# EAGLE design Adafruit ATtiny816 Breakout (EAGLE 9.6.2)
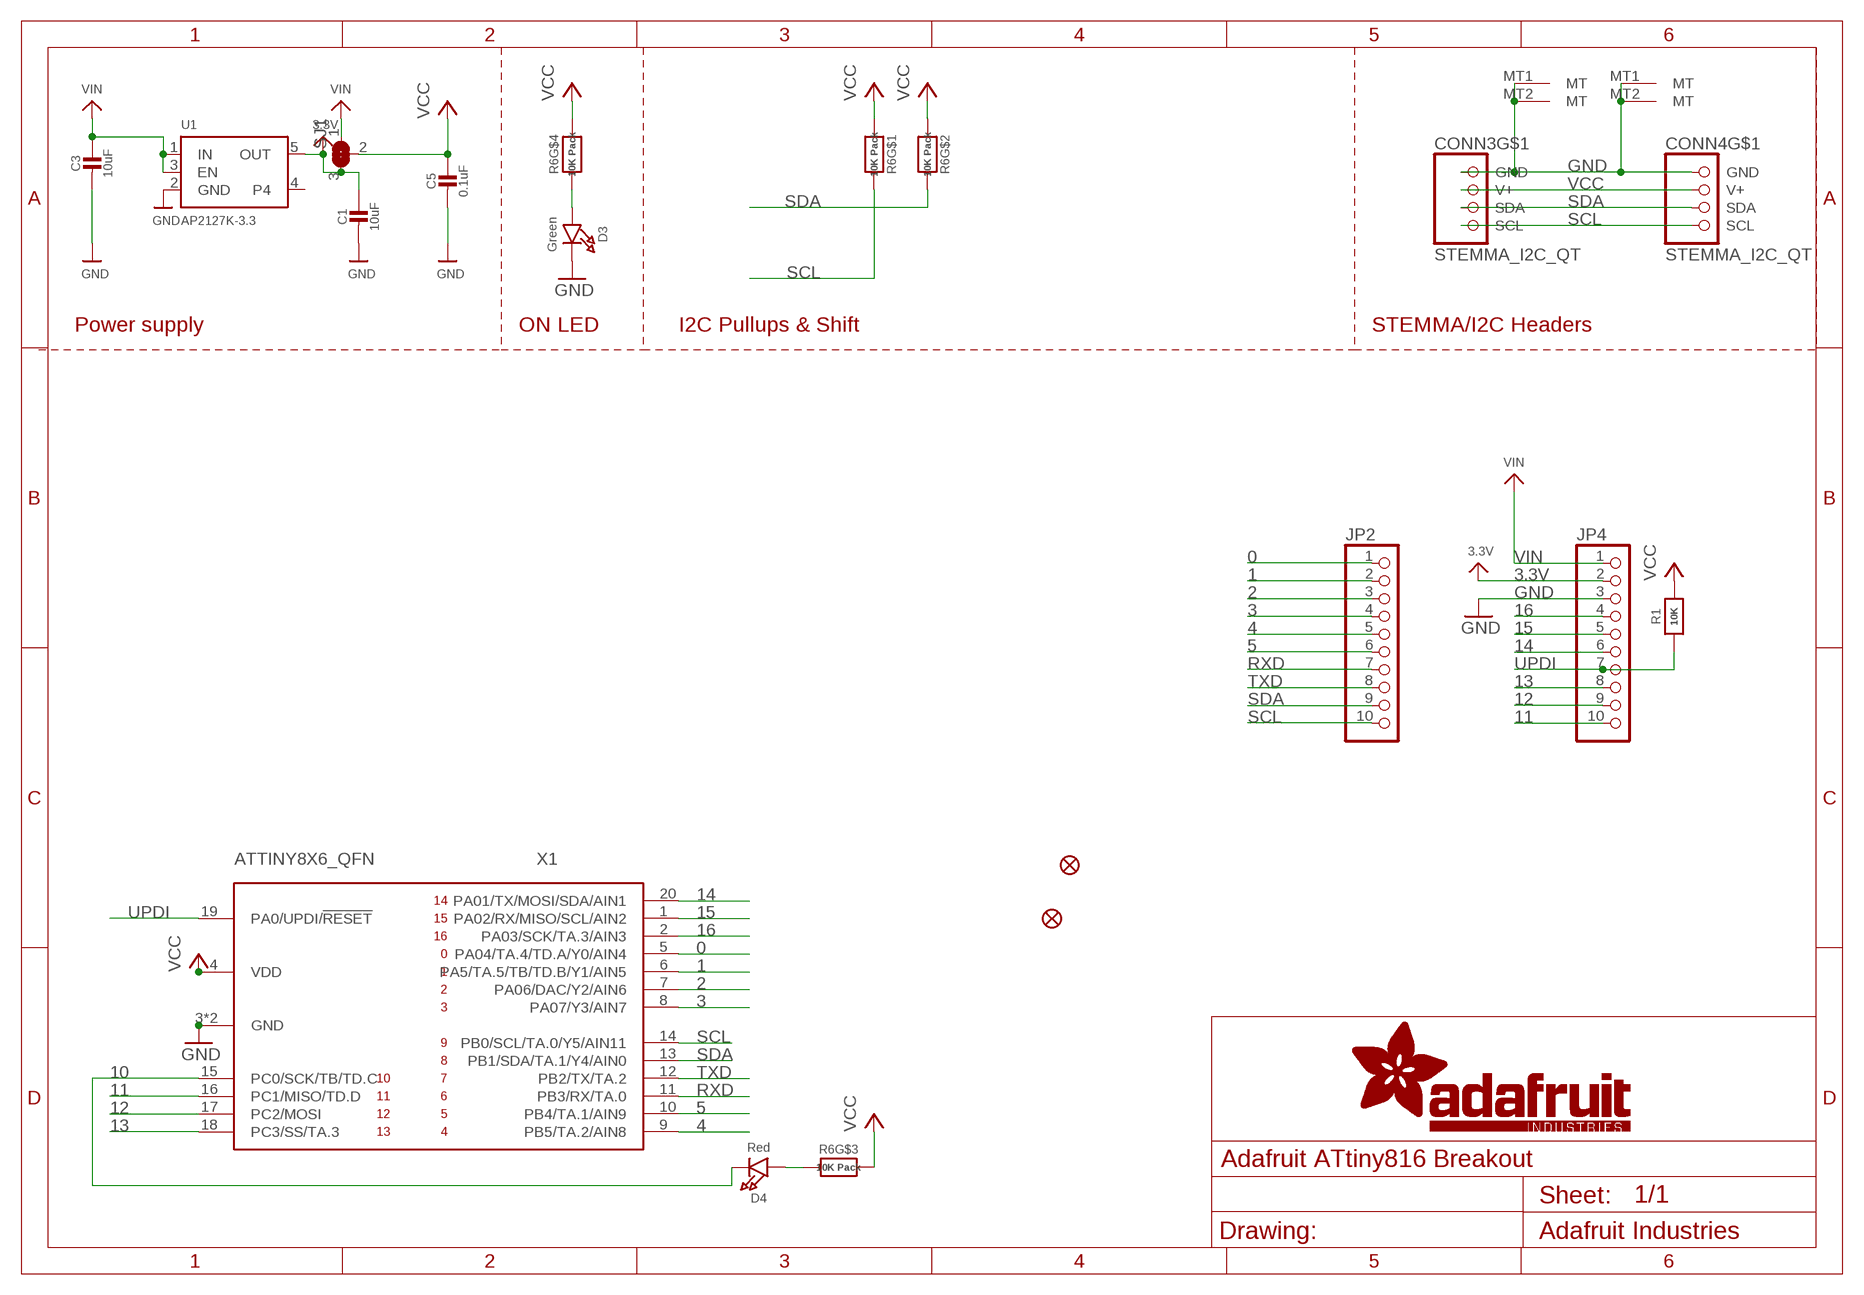
[diagram p0: schematic, sheet 1]

## Parts
C1  10uF  CAP_CERAMIC0805_10MGAP  [0805_10MGAP]
C3  10uF  CAP_CERAMIC0805-NOOUTLINE  [0805-NO]
C5  0.1uF  CAP_CERAMIC0603_NO  [0603-NO]
CONN3  STEMMA_I2C_QT  [JST_SH4]
CONN4  STEMMA_I2C_QT  [JST_SH4]
D3  Green  LED0603_NOOUTLINE  [CHIPLED_0603_NOOUTLINE]
D4  Red  LED0603_NOOUTLINE  [CHIPLED_0603_NOOUTLINE]
FID1  FIDUCIAL_1MM  [FIDUCIAL_1MM]
FID2  FIDUCIAL_1MM  [FIDUCIAL_1MM]
JP2  HEADER-1X1070MIL  [1X10_ROUND70]
JP4  HEADER-1X1070MIL  [1X10_ROUND70]
R1  10K  RESISTOR_0603_NOOUT  [0603-NO]
R6  10K Pack  RESISTOR_4PACK  [RESPACK_4X0603]
SJ1  SOLDERJUMPER_2WAY  [SOLDERJUMPER_2WAY_OPEN_NOPASTE]
U1  AP2127K-3.3  VREG_SOT23-5  [SOT23-5]
X1  ATTINY8X6_QFN  [QFN20_3MM]

## Nets
0: JP2.1 X1.5(PA04/TA.4/TD.A/Y0/AIN4)
1: JP2.2 X1.6(PA5/TA.5/TB/TD.B/Y1/AIN5)
2: JP2.3 X1.7(PA06/DAC/Y2/AIN6)
3: JP2.4 X1.8(PA07/Y3/AIN7)
3.3V [highpower]: C1.1 JP4.2 SJ1.3 U1.5(OUT)
4: JP2.5 X1.9(PB5/TA.2/AIN8)
5: JP2.6 X1.10(PB4/TA.1/AIN9)
10: D4.C X1.15(PC0/SCK/TB/TD.C)
11: JP4.10 X1.16(PC1/MISO/TD.D)
12: JP4.9 X1.17(PC2/MOSI)
13: JP4.8 X1.18(PC3/SS/TA.3)
14: JP4.6 X1.20(PA01/TX/MOSI/SDA/AIN1)
15: JP4.5 X1.1(PA02/RX/MISO/SCL/AIN2)
16: JP4.4 X1.2(PA03/SCK/TA.3/AIN3)
GND [highpower]: C1.2 C3.2 C5.2 CONN3.1(GND) CONN3.MT1(MT) CONN3.MT2(MT) CONN4.1(GND) CONN4.MT1(MT) CONN4.MT2(MT) D3.C JP4.3 U1.2(GND) X1.3(GND) X1.PAD(GND)
N$1: D3.A R6.4
N$4: D4.A R6.3
RXD: JP2.7 X1.11(PB3/RX/TA.0)
SCL: CONN3.4(SCL) CONN4.4(SCL) JP2.10 R6.8 X1.14(PB0/SCL/TA.0/Y5/AIN11)
SDA: CONN3.3(SDA) CONN4.3(SDA) JP2.9 R6.7 X1.13(PB1/SDA/TA.1/Y4/AIN0)
TXD: JP2.8 X1.12(PB2/TX/TA.2)
UPDI: JP4.7 R1.1 X1.19(PA0/UPDI/!RESET)
VCC [highpower]: C5.1 CONN3.2(V+) CONN4.2(V+) R1.2 R6.1 R6.2 R6.5 R6.6 SJ1.2 X1.4(VDD)
VIN [highpower]: C3.1 JP4.1 SJ1.1 U1.1(IN) U1.3(EN)
Unconnected: U1.4

## Notes on the sheet
- Power supply | ON LED | I2C Pullups & Shift | STEMMA/I2C Headers

## Library data of the parts
C1 C3 C5 = microbuilder:CAP_CERAMIC: Ceramic Capacitors For new designs, use the packages preceded by an '_' character since they are more reliable: The following footprints should be used on most boards: _0402 - Standard footprint for regular board layouts _0603 - Standard footprint for regular board layouts _0805 - Standard footprint for regular board layouts _1206 - Standard footprint for regular board layouts For extremely tight-pitch boards where space is at a premium, the following 'micro-pitch' footprints can be used (smaller pads, no silkscreen outline, etc.): _0402MP - Micro-pitch footprint for very dense/compact boards _0603MP - Micro-pitch footprint for very dense/compact boards _0805MP - Micro-pitch footprint for very dense/compact boards _1206MP - Micro-pitch footprint for very dense/compact boards
CONN3 CONN4 = adafruit_electromech:STEMMA_I2C; LCSC: C2845363
D3 D4 = microbuilder:LED: LED 0603 - 0603 Surface Mount Package 2mA: Green LED - Low Power (3.9mcd, 2ma, 1.7Vf) - Digikey: 475-2709-2-ND Orange LED - Low Power (9.8mcd, 2ma, 1.8Vf) - Digikey: 475-1194-2-ND Red LED - Low Power (5mcd, 2ma, 1.8Vf) - Digikey: 475-1195-2-ND Yellow LED - Low Power (7mcd, 2ma, 1.8Vf) - Digikey: 475-1196-2-ND 5mA: Blue LED - Low Power (17mcd, 5ma, 2.9Vf) - Digikey: LNJ937W8CRACT-ND 0805 - 0805 Surface Mount Package 2mA: Red LED (8.8mcd, 2mA, 1.8Vf, Clear) - Low Power [Digikey: 475-2510-1-ND] Green LED (5mcd, 2mA, 1.8Vf, Clear) - Low Power [Digikey: 475-2730-1-ND] Yellow LED (11.3mcd, 2mA, 1.8Vf, Clear) - Low Power [Digikey: 475-2555-1-ND] 20mA: Red LED (104mcd, 20mA, Diffused) - LS R976 [Digikey: 475-1278-6-ND] Red LED (12mcd, 20mA, 2.0Vf, Clear) - APT2012EC [Digikey: 754-1128-1-ND] Green LED (15mcd, 20mA, 2.2Vf, Clear) - APT2012GC [Digikey: 754-1131-1-ND] Orange LED (160mcd, 20mA, 2.1Vf, Clear) - APT2012SECK [Digikey: 754-1130-1-ND] 1206 - 1206 Surface Mount Package Green LED (26mcd, 20mA, Diffused) - LG N971 [Digikey: 475-1407-6-ND] Red LED (15mcd, 20mA, Diffused) - LH N974 [Digikey: 475-1416-6-ND] Cree - Cree High-Power Surface Mount LEDs XPEBWT-L1-0000-00D50 - White 111lm 350mA 2.9Vf 6200K 110° XTEAWT-00-0000-00000LEE3 - White 114lm 350mA 2.85Vf 5000K 115° Everlight - Everlight 45-21 Series Surface Mount LEDs 45-21/QK2C-B2832AC2CB2/2T - Warm White 2000mcd 20mA 3.25Vf 3050K 120° 45-21/LK2C-B38452C4CB2/2T - Nuetral White 2000mcd 20mA 3.25Vf 4150K 120° 45-21/LK2C-B50634C6CB2/2T - Cold White 2200mcd 20mA 3.25Vf 5650K 120° PLCC2 Reverse Mount LS T77K-J1L2-1-0-2-R18-Z - Red 11.25mcd 2mA 1.8Vf 630nm 120° LO T77K-L1M2-24-Z - Orange 19.6mcd 2mA 1.8Vf 606nm 120° LY T77K-K2M1-26-Z - Yellow 15.7mcd 2mA 1.8Vf 587nm 120°; ROT: 270
FID1 FID2 = microbuilder:FIDUCIAL: Fiducial Alignment Points Various fiducial points for machine vision alignment.; BOM: EXCLUDE
JP2 JP4 = microbuilder:HEADER-1X10: PIN HEADER
R1 = microbuilder:RESISTOR: Resistors For new designs, use the packages preceded by an '_' character since they are more reliable: The following footprints should be used on most boards: _0402 - Standard footprint for regular board layouts _0603 - Standard footprint for regular board layouts _0805 - Standard footprint for regular board layouts _1206 - Standard footprint for regular board layouts For extremely tight-pitch boards where space is at a premium, the following 'micro-pitch' footprints can be used (smaller pads, no silkscreen outline, etc.): _0402MP - Micro-pitch footprint for very dense/compact boards _0603MP - Micro-pitch footprint for very dense/compact boards _0805MP - Micro-pitch footprint for very dense/compact boards _1206MP - Micro-pitch footprint for very dense/compact boards
R6 = microbuilder:RESISTOR_4PACK: Resistor Packs (4 resistors) 4 x 0603 10K 1/16W - Digikey: YC164J-10KCT-ND
SJ1 = microbuilder:SOLDERJUMPER_2WAY: 2-Way Solder Jumper
U1 = adafruit_power:VREG_SOT23-5: SOT23-5 Fixed Voltage Regulators Part Current Out V Out V In V Dropout θJA (°C/W) TJ (°C) Digikey Part No. ADP121 150mA 3.3V 3.4-5.5V 0.09V @ 150mA -- -- ADP121-AUJZ33R7CT-ND ADP121 150mA 3.0V 3.1-5.5V 0.09V @ 150mA -- -- ADP121-AUJZ30R7CT-ND ADP122 300mA 3.3V 3.4-5.5V 0.085V @ 300mA -- -- ADP122AUJZ-3.3-R7CT-ND ADP1712 300mA 3.3V 3.5-5.5V 0.17V @ 300mA -- -- ADP1712AUJZ-3.3-R7TR-ND AP7311 (Low Cost) 150mA 3.3V 3.5-6V 0.15V @ 150mA -- -- AP7311-33WG-7DICT-ND LD39015M18R 150mA 1.8V 1.9V-5.5V 0.08V @ 100mA -- -- 497-6977-1-ND LP2985A-33DBVR 150mA 3.3V 3.3-16V 0.28V @ 150mA 206 150 296-18479-1-ND MCP1824T-3302E/OT 300mA 3.3V 3.5V-6V 0.2V @ 300mA -- -- MCP1824T-3302E/OTCT-ND MIC5205-2.5YM5 TR 150mA 2.5V 2.7-16V 0.165V @ 150mA -- -- 576-1257-2-ND MIC5205-3.0YM5 TR 150mA 3.0V 3.2V-16V 0.165V @ 150mA -- -- 576-1258-2-ND MIC5205-3.3YM5 TR 150mA 3.3V 3.5V-16V 0.165V @ 150mA -- -- 576-1259-2-ND TPS780330220 150mA 3.3V+2.2V 3.6-5.5V 250mV Max -- -- 296-23332-1-ND TDA3663/N1,135 100mA 3.3V 3.5-45V 0.18V @ 50mA -- -- 568-5343-1-ND Max operating temp can be calculated using θJA, TJ (max junction temperature), and power in watts. Set the "Maximum Ambient Temperature" until it reaches TJ ("Max Junction Temperature"), which is the absolute limit for safe use of the regulator: Heat Sink Temperature Calculator <http://www.daycounter.com/Calculators/Heat-Sink-Temperature-Calculator.phtml> For example, With 12V source into a 3.3V LP2985 and a 30mA load, we are dissipating (12V-3.3V) * 0.03A = 0.261W. With a θJA of 206 °C/W, a TJ of 150°C, and 261mW we can safely use the chip without a heat sink up to 75°C (=147.1°C Junction Temperature).; JLC_ROTATION: 270
X1 = adafruit_micro:ATTINY8X6

## Net classes
1 highpower: width 0.254 mm, drill 0.483 mm

## Board
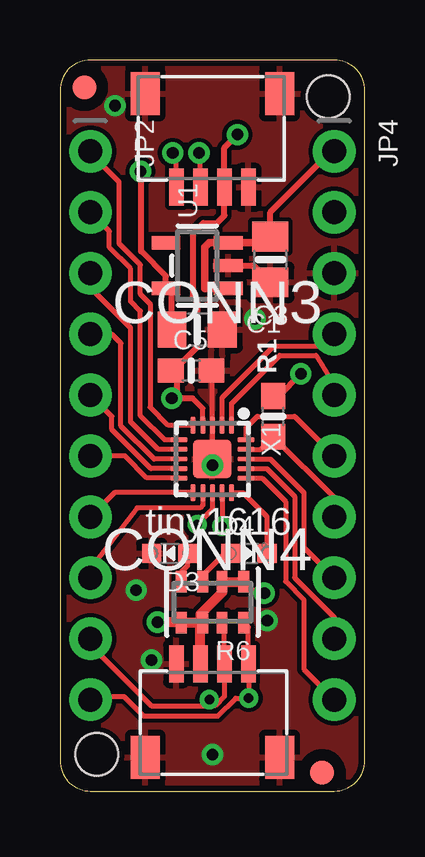
[diagram p1: board, top side]
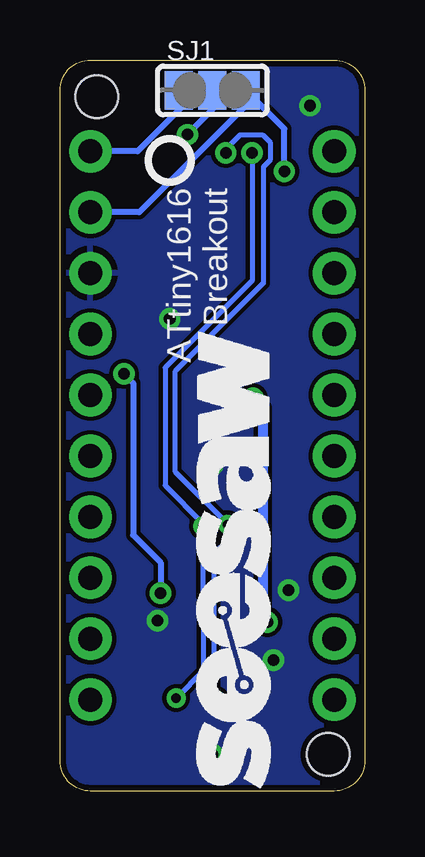
[diagram p2: board, bottom side, seen from below]

Size 12.7 x 30.48 mm. Coordinates in mm from the lower left corner, seen from the top.
Outline: 0,29.21 0,1.27 arc90 1.27,0 11.43,0 arc90 12.7,1.27 12.7,29.21 arc90 11.43,30.48 1.27,30.48 arc90 0,29.21
Copper layers (1*16): Top 0.035mm / dielectric 1.5mm / Bottom 0.035mm
Design rules "adafruit 7-7": minimum track width 7mil, minimum drill 15.5mil, track to track 7mil, track to pad 7mil, pad to pad 7mil, via to via 7mil, smd to smd 7mil, copper to edge 10mil, drill to drill 8mil, minimum pad ring 10mil, minimum via ring 8mil, stop-mask expansion 2mil, vias tented up to drill 20mil, thermal gap 10mil
Holes 1.78 mm at 11.18,28.96 1.52,1.52

### Footprints (pad centres in the part's own frame; a part is rotated, then mirrored left to right if it is on the bottom)
0805_10MGAP = smd 1.2 x 1.5: 1 -1.05,0; 2 1.05,0
0805-NO = smd 1.24 x 1.5: 1 -0.95,0; 2 0.95,0
0603-NO = smd 1.075 x 1: 1 -0.85,0; 2 0.85,0
JST_SH4 = smd 0.6 x 1.55: 1 -1.5,2.006; 2 -0.5,2.006; 3 0.5,2.006; 4 1.5,2.006 | smd 1.2 x 1.8: MT1 -2.8,-1.894; MT2 2.8,-1.894
CHIPLED_0603_NOOUTLINE = smd 0.8 x 0.8: A 0,-0.75; C 0,0.75
FIDUCIAL_1MM = smd 1 x 1: 1 0,0
1X10_ROUND70 = drill 1 pad 1.778: 1 -11.43,0; 2 -8.89,0; 3 -6.35,0; 4 -3.81,0; 5 -1.27,0; 6 1.27,0; 7 3.81,0; 8 6.35,0; 9 8.89,0; 10 11.43,0
RESPACK_4X0603 = smd 0.45 x 0.9: 1 -1.3,-0.85; 2 -0.4,-0.85; 3 0.4,-0.85; 4 1.3,-0.85; 5 1.3,0.85; 6 0.4,0.85; 7 -0.4,0.85; 8 -1.3,0.85
SOLDERJUMPER_2WAY_OPEN_NOPASTE = smd 1.168 x 1.6: 1 -1.397,0; 2 0,0; 3 1.397,0
SOT23-5 = smd 0.55 x 1.2: 1 -0.95,-1.3; 2 0,-1.3; 3 0.95,-1.3; 4 0.95,1.3; 5 -0.95,1.3
QFN20_3MM = smd 0.7 x 0.2: 1 -1.4,0.8; 2 -1.4,0.4; 3 -1.4,0; 4 -1.4,-0.4; 5 -1.4,-0.8; 11 1.4,-0.8; 12 1.4,-0.4; 13 1.4,0; 14 1.4,0.4; 15 1.4,0.8 | smd 0.2 x 0.7: 6 -0.8,-1.4; 7 -0.4,-1.4; 8 0,-1.4; 9 0.4,-1.4; 10 0.8,-1.4; 16 0.8,1.4; 17 0.4,1.4; 18 0,1.4; 19 -0.4,1.4; 20 -0.8,1.4 | smd 1.6 x 1.6: PAD 0,0

### Placement (x,y rotation side)
C1  5.71,19.24 0 top
C3  8.76,22.16 270 top
C5  5.46,17.53 0 top
CONN3  6.35,27.18 180 top
CONN4  6.35,3.3 0 top
D3  4.57,9.91 90 top
D4  7.87,9.91 270 top
FID1  10.92,0.76 0 top
FID2  1.02,29.34 0 top
JP2  1.27,15.24 270 top
JP4  11.43,15.24 270 top
PLABEL0  [PLABEL0]  2.54,19.05 0 top
PLABEL1  [PLABEL1]  2.54,21.59 0 top
PLABEL2  [PLABEL2]  2.67,13.97 0 top
PLABEL3  [PLABEL3]  2.67,11.43 0 top
PLABEL4  [PLABEL4]  2.67,8.89 0 top
PLABEL5  [PLABEL5]  2.67,6.41 90 top
PLABEL6  [PLABEL6]  2.79,3.94 90 top
PLABEL7  [PLABEL7]  10.54,2.41 0 top
PLABEL8  [PLABEL8]  9.59,8.89 0 top
PLABEL9  [PLABEL9]  9.91,13.46 0 top
PLABEL10  [PLABEL10]  10.03,16.51 90 top
PLABEL11  [PLABEL11]  9.65,19.05 0 top
PLABEL12  [PLABEL12]  9.65,6.48 0 top
PLABEL13  [PLABEL13]  10.03,21.59 0 top
PLABEL14  [PLABEL14]  9.65,24.51 0 top
PLABEL15  [PLABEL15]  10.03,26.8 270 top
PLABEL17  [PLABEL17]  2.67,24 0 top
PLABEL18  [PLABEL18]  2.73,26.92 0 top
PLABEL19  [PLABEL19]  2.92,23.62 0 top
PLABEL20  [PLABEL20]  2.92,21.21 0 top
PLABEL21  [PLABEL21]  2.92,18.54 0 top
PLABEL22  [PLABEL22]  2.41,9.4 0 top
PLABEL23  [PLABEL23]  10.03,19.18 0 top
PLABEL24  [PLABEL24]  2.41,27.3 0 top
PLABEL25  [PLABEL25]  2.41,24.38 0 top
PLABEL26  [PLABEL26]  9.78,2.79 0 top
PLABEL27  [PLABEL27]  1.65,27.56 0 top
PLABEL28  [PLABEL28]  2.67,16.51 0 top
PLABEL29  [PLABEL29]  3.05,16.13 0 top
PLABEL30  [PLABEL30]  3.05,13.59 0 top
PLABEL31  [PLABEL31]  9.14,19.56 0 top
PLABEL32  [PLABEL32]  9.02,16.76 0 top
PLABEL33  [PLABEL33]  9.78,13.46 0 top
PLABEL35  [PLABEL35]  2.92,16.51 90 bottom
PLABEL36  [PLABEL36]  2.92,18.92 90 bottom
PLABEL37  [PLABEL37]  2.92,21.59 90 bottom
PLABEL38  [PLABEL38]  2.92,13.97 90 bottom
PLABEL39  [PLABEL39]  2.92,11.43 90 bottom
PLABEL40  [PLABEL40]  2.92,9.02 90 bottom
PLABEL41  [PLABEL41]  2.79,6.29 90 bottom
PLABEL42  [PLABEL42]  2.92,3.68 90 bottom
PLABEL43  [PLABEL43]  2.92,24.13 90 bottom
PLABEL44  [PLABEL44]  9.91,6.35 90 bottom
PLABEL45  [PLABEL45]  9.91,8.7 90 bottom
PLABEL46  [PLABEL46]  9.78,14.35 90 bottom
PLABEL47  [PLABEL47]  9.78,16.51 90 bottom
PLABEL48  [PLABEL48]  9.78,19.05 90 bottom
PLABEL49  [PLABEL49]  9.91,3.81 90 bottom
PLABEL50  [PLABEL50]  9.84,11.43 90 bottom
PLABEL51  [PLABEL51]  9.78,21.59 90 bottom
PLABEL52  [PLABEL52]  9.91,24 90 bottom
PLABEL53  [PLABEL53]  9.91,26.54 90 bottom
PLABEL54  [PLABEL54]  2.92,26.54 90 bottom
PLABEL55  [PLABEL55]  2.16,29.72 0 bottom
PLABEL56  [PLABEL56]  6.22,27.43 0 bottom
PLABEL57  [PLABEL57]  7.37,0.64 90 bottom
PLABEL58  [PLABEL58]  9.4,29.08 90 bottom
R1  8.89,15.62 90 top
R6  6.35,7.87 180 top
SJ1  6.35,29.21 0 bottom
U1  5.71,21.91 90 top
U$7  [SEESAW_LOGO]  3.94,0.13 90 bottom
U$12  [PCBFEAT-REV-040]  8.13,26.29 270 bottom
X1  6.35,13.84 270 top

### Tracks (layer width: path | path; a pad name or v marks a point on that pad's centre or on a via)
0
  Top 0.203: X1.5 4.52,15.24 3.76,16 3.76,20.31 3.35,20.72 3.35,21.95 2.46,22.83 2.46,25.39 1.27,26.58 JP2.1
1
  Top 0.203: X1.6 4.36,14.64 3.35,15.65 3.35,20.02 2.95,20.42 2.95,21.78 2.06,22.66 2.06,23.34 JP2.2
2
  Top 0.203: X1.7 4.1,14.24 2.95,15.39 2.95,19.3 1.27,20.98 JP2.3
3
  Top 0.203: JP2.4 2.16,19.05 2.54,18.67 2.54,15.22 3.92,13.84 X1.8
3.3V  (via drill 0.48)
  Top 0.254: v3.35,25.83 3.38,25.81 3.38,22.5 4.42,21.46 U1.5 4.67,20.71 C1.1
  Bottom 0.254: JP4.2 9.4,24.13 4.95,28.57 SJ1.3 3.35,27.61 v3.35,25.83
4
  Top 0.203: JP2.5 2.16,15.62 2.16,15.07 3.78,13.44 X1.9
5
  Top 0.203: X1.10 4.93,13.06 3.62,13.06 2.72,13.97 JP2.6
10
  Top 0.203: X1.15 7.62,12.44 8.62,11.44 D4.C
11
  Top 0.203: X1.16 8.42,13.04 9.4,12.06 9.4,8.73 10.16,7.97 10.16,5.08 JP4.10
12
  Top 0.203: X1.17 8.62,13.44 9.78,12.29 9.78,8.89 11.43,7.24 JP4.9
13
  Top 0.203: X1.18 8.76,13.84 10.16,12.45 10.16,10.16 JP4.8
14
  Top 0.203: X1.20 7.75,15.15 8.22,15.62 9.78,15.62 JP4.6
15
  Top 0.203: X1.1 7.15,16.16 9.15,18.16 10.67,18.16 11.43,16.92 JP4.5
16
  Top 0.203: X1.2 6.75,16.4 8.89,18.54 10.92,18.54 JP4.4
GND  (via drill 0.48)
  Top 0.203: X1.PAD X1.3 6.35,17.49 C5.2
  Top 0.254: U1.2 8.07,21.91 C3.2
  other vias: 6.35,1.52 3.81,5.46 8.13,19.68 2.29,28.57 8.64,7.11 6.35,13.59 3.17,8.38
  pour Top: 0.06,30.45 0.06,30.42 12.7,30.45 12.7,0 0.03,0
  pour Bottom: 0.06,30.45 0.06,30.42 12.7,30.45 12.7,0 0.03,0
N$1
  Top 0.203: R6.4 5.05,9.13 5.32,9.4 D3.A
N$2
  Bottom 0.254: 6.73,29.08 7.37,29.08
N$4
  Top 0.203: R6.3 5.95,9 6.86,9.91 D4.A
RXD
  Top 0.203: X1.11 2.28,12.44 JP2.7
SCL  (via drill 0.39, 0.48)
  Top 0.203: R6.8 7.85,6.82 CONN4.4 7.86,5.8 v7.86,3.87 7.32,3.87 6.57,3.13 3.47,3.13 2.67,3.94 1.4,3.94 JP2.10 | X1.14 v6.75,11.05 v6.74,11.04 | CONN3.4 4.85,26.46 v4.7,26.61
  Bottom 0.203: v4.7,26.61 4.7,21.27 8.32,17.65 8.32,12.74 6.74,11.17 v6.74,11.04 6.75,11.05 6.73,5 v7.86,3.87
SDA  (via drill 0.39, 0.48)
  Top 0.203: v6.22,3.81 6.22,3.56 | R6.7 6.85,6.92 CONN4.3 6.85,3.94 6.46,3.56 6.22,3.56 | 6.22,3.56 3.81,3.56 1.27,6.1 JP2.9 | CONN3.3 5.85,26.55 v5.79,26.61 | X1.13 6.35,11.75 v5.71,11.11
  Bottom 0.203: v6.22,3.81 6.29,3.87 6.29,9.91 5.71,10.48 v5.71,11.11 5.71,11.13 7.91,13.33 7.91,17.48 4.23,21.17 4.23,26.02 3.95,26.3 3.95,27.04 4.26,27.36 5.2,27.36 5.79,26.76 v5.79,26.61
TXD
  Top 0.203: X1.12 5.95,11.92 5.84,11.81 3.21,11.81 1.27,9.26 JP2.8
UPDI
  Top 0.203: X1.19 8.36,14.24 R1.1 11.43,12.23 JP4.7
VCC  (via drill 0.48)
  Top 0.203: X1.4 5.95,15.95 5.53,16.37
  Top 0.254: v7.39,27.37 6.85,26.83 CONN3.2 6.85,24 6.54,23.69 5.97,23.69 5.52,23.24 5.52,20.57 5.71,20.38 5.71,18.5 4.74,17.53 C5.1 4.87,17.27 4.87,16.37 | 5.53,16.37 v4.66,16.37 | R1.2 9.11,16.47 v10.03,17.4 | v8.51,8.26 8.51,8.34 8.03,8.34 R6.1
  Top 0.406: CONN4.2 5.85,6.92 | 5.85,6.92 R6.6 | 5.85,6.92 5.75,7.02 R6.5 4.09,7.02 v4.06,7.05 | R6.1 R6.2 6.75,8.27 5.85,7.37 5.85,6.92 | v4.66,16.37 4.87,16.37
  Bottom 0.254: v7.39,27.37 6.35,28.41 SJ1.2 | v10.03,17.4 9.65,17.02 9.65,10.67 8.51,9.53 v8.51,8.26
  Bottom 0.406: v4.66,16.37 4.25,15.97 4.25,15.86 4.25,7.24 v4.06,7.05
VIN
  Top 0.254: C3.1 8.76,24.13 11.3,26.67 JP4.1 | 6.6,22.86 U1.3 7.49,22.86
  Top 0.305: 7.49,22.86 8.51,22.86 C3.1 | U1.1 6.03,20.96 6.03,22.67 6.22,22.86 6.6,22.86
  Bottom 0.254: SJ1.1 7.75,28.7 7.62,28.57 7.62,28.51 9.46,26.67 JP4.1

### Text on the board
tPlace: tiny1616
bPlace: ATtiny1616 / Breakout
Pinguin_tBackup: * | ~ | 0 | Vin | ~ | 3v | 1 | * | 2 | G | * | 3 | * | * | ~ | 16 | 4 | * | 15 | * | 5 | * | * | 14 | 6 | ~ | 7 | 13 | SDA | 12 | SCL | 11 | ~
Pinguin_bBackup: 3.3V | Vin | 0 | Vio | Vin | 1 | 3v | 2 | G | 3 | 16 | 4 | 15 | 5 | 14 | 6 | UPDI | 7 | 13 | SDA | 12 | SCL | 11 | STEMMA QT